# EAGLE design latch_THT_XOR (EAGLE 8.3.1)
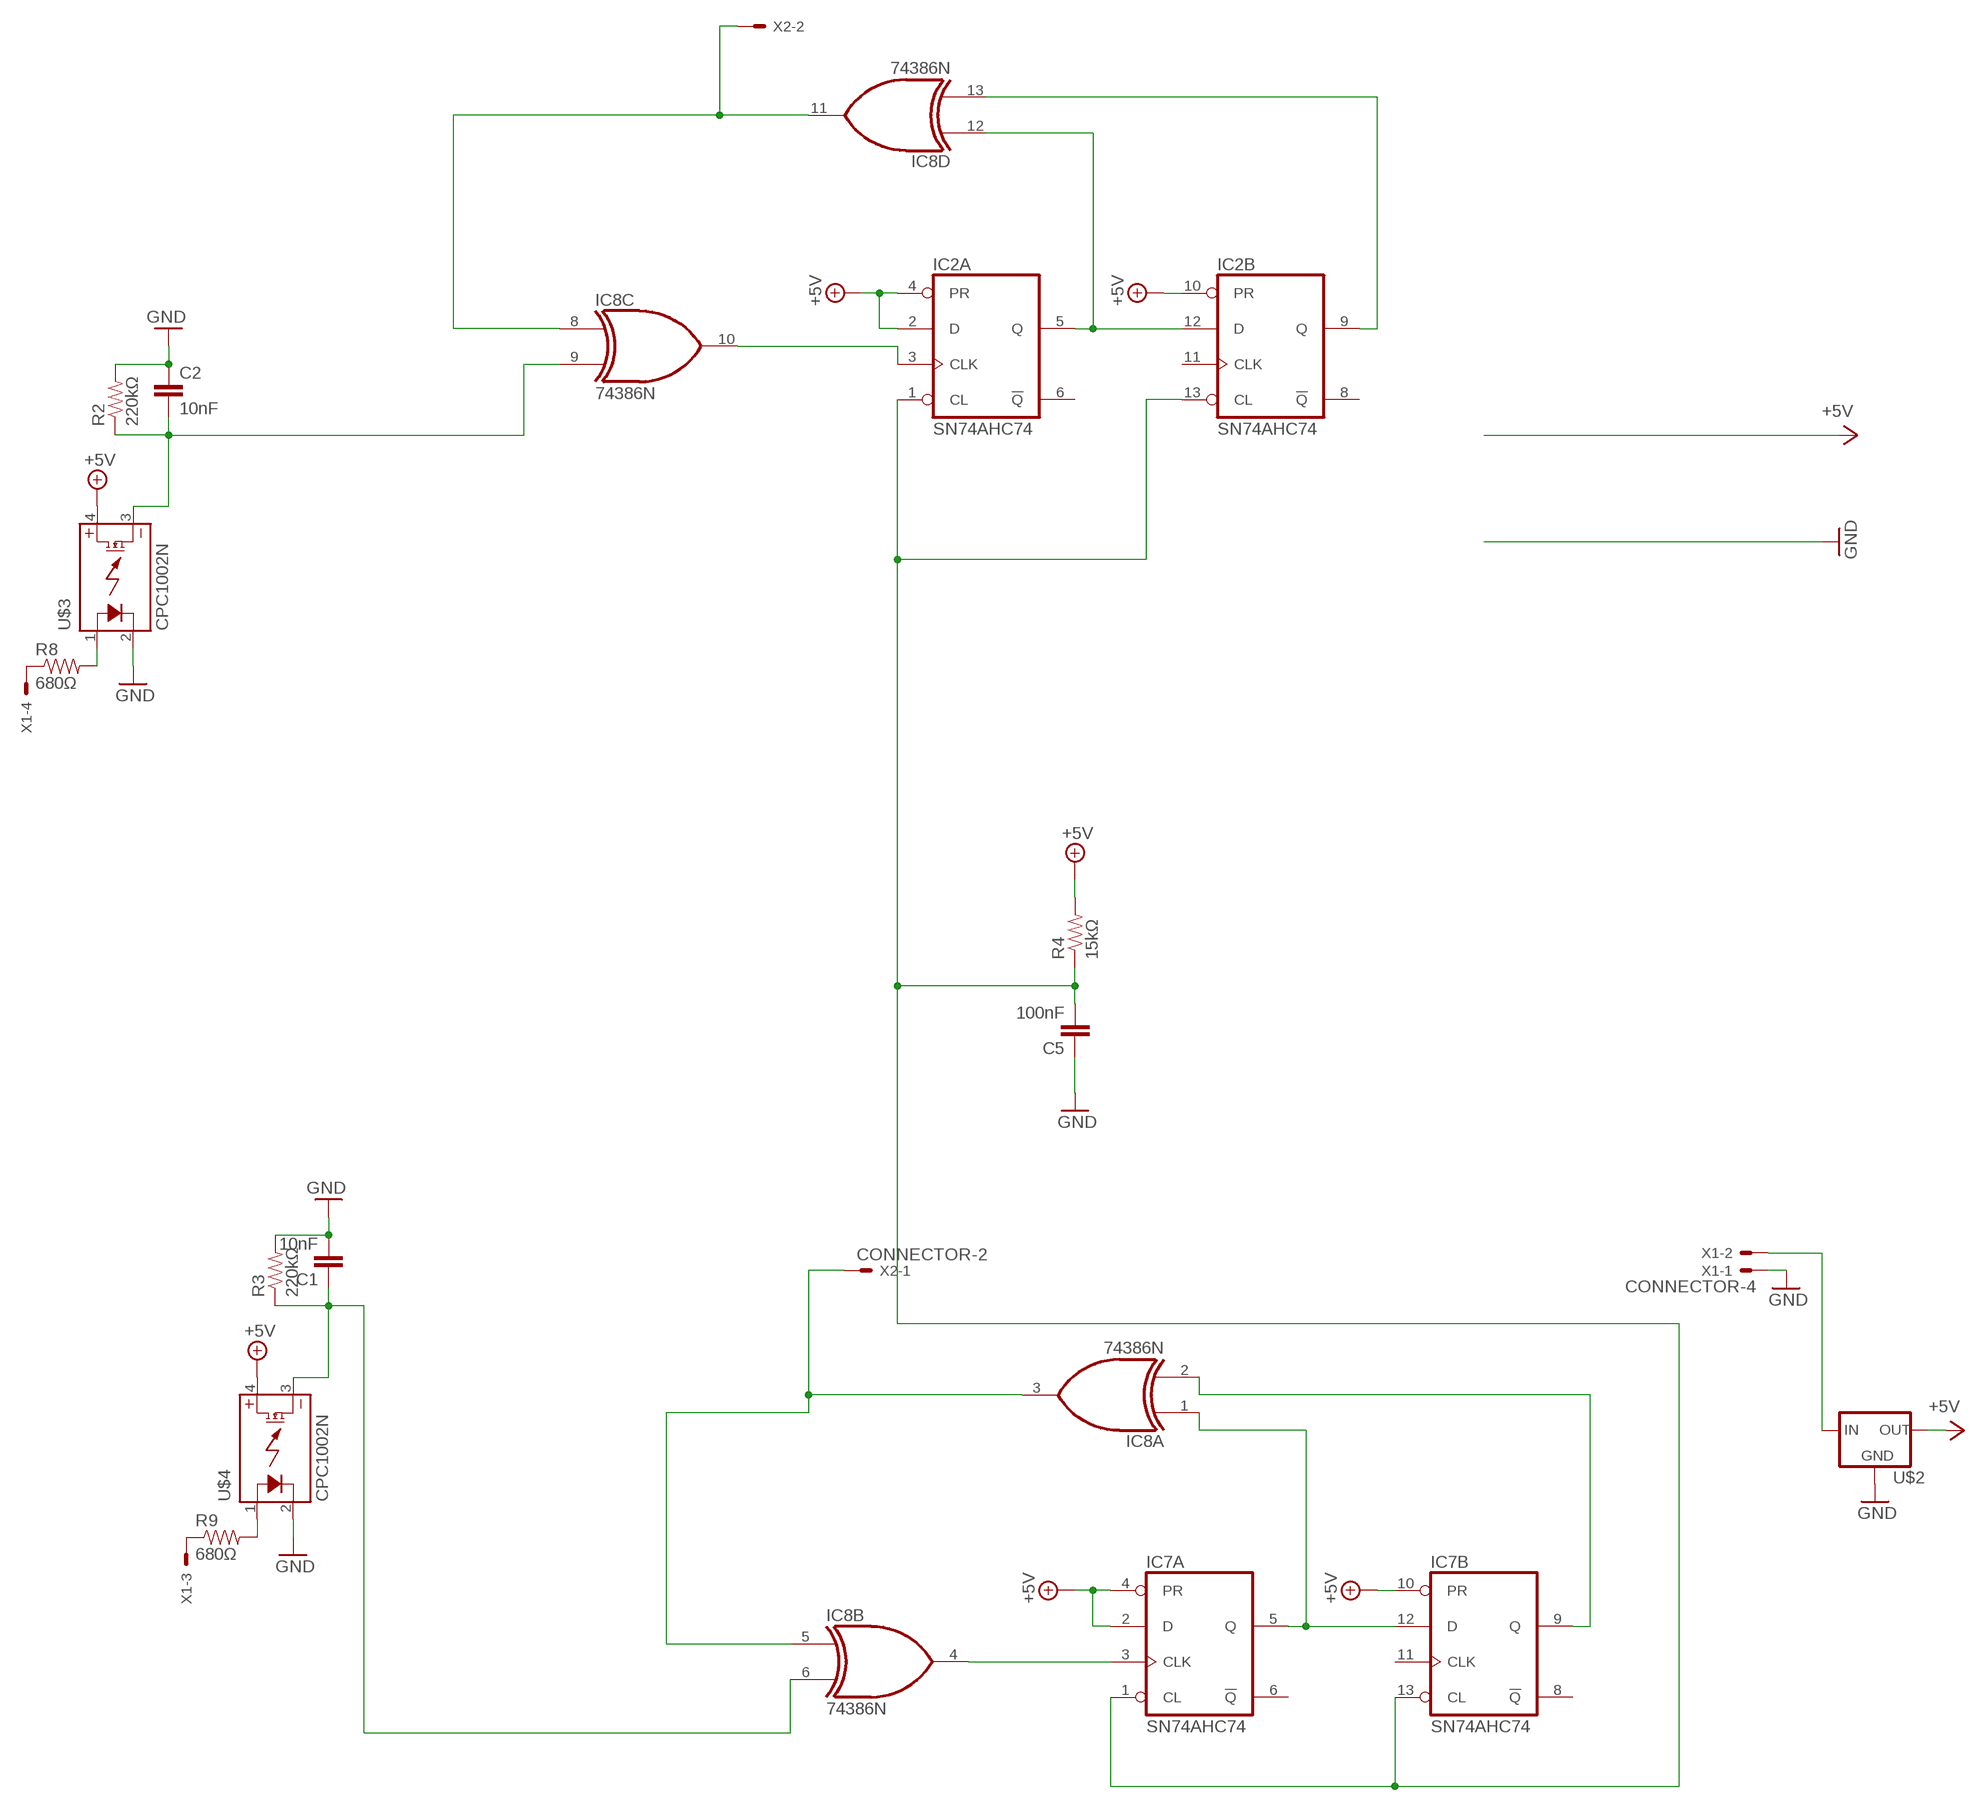
[diagram p0: schematic, sheet 1]

## Parts
C1  10nF  CAP_  [AXIAL-5MM]
C2  10nF  CAP_  [AXIAL-5MM]
C5  100nF  CAP_  [AXIAL-5MM]
IC2  SN74AHC74  [DIL14]
IC7  SN74AHC74  [DIL14]
IC8  74386N  [DIL14]
R2  220kΩ  RESISTORPTH-1/4W  [AXIAL-0.4]
R3  220kΩ  RESISTORPTH-1/4W  [AXIAL-0.4]
R4  15kΩ  RESISTORPTH-1/4W  [AXIAL-0.4]
R8  680Ω  RESISTORPTH-1/4W  [AXIAL-0.4]
R9  680Ω  RESISTORPTH-1/4W  [AXIAL-0.4]
U$2  5VREG_LM340-NLM340T-5.0/NOPB  [TO-220]
U$3  CPC1002N  [SOP04]
U$4  CPC1002N  [SOP04]
X1  CONNECTOR-4  [MINIFIT_5566-4]
X2  CONNECTOR-2  [MINIFIT_5566-2]

## Nets
12V: U$2.1(IN) X1.2
+5V: IC2.2(A:D) IC2.4(A:PR) IC2.10(B:PR) IC7.2(A:D) IC7.4(A:PR) IC7.10(B:PR) R4.P$2 U$2.3(OUT) U$3.4(DC+) U$4.4(DC+)
BMS_IN: R9.P$2 U$4.1(CONTROL+)
GND: C1.P$2 C2.P$1 C5.P$1 R2.P$2 R3.P$2 U$2.2(GND) U$3.2(CONTROL-) U$4.2(CONTROL-) X1.1
IMD_IN: R8.P$2 U$3.1(CONTROL+)
N$1: IC2.5(A:Q) IC2.12(B:D) IC8.12(D:I0)
N$2: IC2.9(B:Q) IC8.13(D:I1)
N$3: C5.P$2 IC2.1(A:CL) IC2.13(B:CL) IC7.1(A:CL) IC7.13(B:CL) R4.P$1
N$4: IC8.8(C:I0) IC8.11(D:O) X2.2
N$5: IC2.3(A:CLK) IC8.10(C:O)
N$6: IC7.3(A:CLK) IC8.4(B:O)
N$8: C1.P$1 IC8.6(B:I1) R3.P$1 U$4.3(DC-)
N$9: C2.P$2 IC8.9(C:I1) R2.P$1 U$3.3(DC-)
N$10: IC7.5(A:Q) IC7.12(B:D) IC8.1(A:I0)
N$11: IC7.9(B:Q) IC8.2(A:I1)
N$12: IC8.3(A:O) IC8.5(B:I0) X2.1
N$32: R8.P$1 X1.4
N$33: R9.P$1 X1.3
Unconnected: IC2.6(A:!Q) IC2.8(B:!Q) IC2.11(B:CLK) IC7.6(A:!Q) IC7.8(B:!Q) IC7.11(B:CLK)

## Power pins joined to a net without a drawn wire
+5V: IC2.14(P:VCC) IC7.14(P:VCC) IC8.14(P:VCC)
GND: IC2.7(P:GND) IC7.7(P:GND) IC8.7(P:GND)

## Library data of the parts
C1 C2 C5 = HyTechDevices:CAP: Capacitor Standard 0603 ceramic capacitor, and 0.1" leaded capacitor.
IC2 IC7 = HyTechDevices:SN74AHC74: TI SN74AHC74 Dual positive edge triggered D-type FLIP FLOP
IC8 = 74xx-us:74*386: Quadruple 2-input EXCLUSIVE-OR (XOR) gate
R2-R4 R8 R9 = HyTechDevices:RESISTOR: Resistor Basic schematic elements and footprints for 0603, 1206, and PTH resistors.
U$2 = HyTechDevices:5VREG_LM340-N: Voltage Regulator 5v linear voltage regulator Datasheet <http://www.mouser.com/ProductDetail/Texas-Instruments/LM340MPX-50-NOPB/?qs=X1J7HmVL2ZGZwtTFRQ9ItA%3D%3D> MAX current out: 1.5A MAX voltage in: 35V
U$3 U$4 = HyTechDevices:CPC1002N: IXYS Solid State Relay .7A
X1 = HyTechDevices:CONNECTOR-4: Mini-Fit Junior connector 4 pole Source: http://www.molex.com; OC_FARNELL: unknown; OC_NEWARK: unknown
X2 = HyTechDevices:CONNECTOR-2: Mini-Fit Junior connector 2 pole Source: http://www.molex.com; OC_FARNELL: 1822072; OC_NEWARK: unknown

## Net classes
0 default: width 0.406 mm, drill 0.406 mm, clearance 0.406 mm

## Board
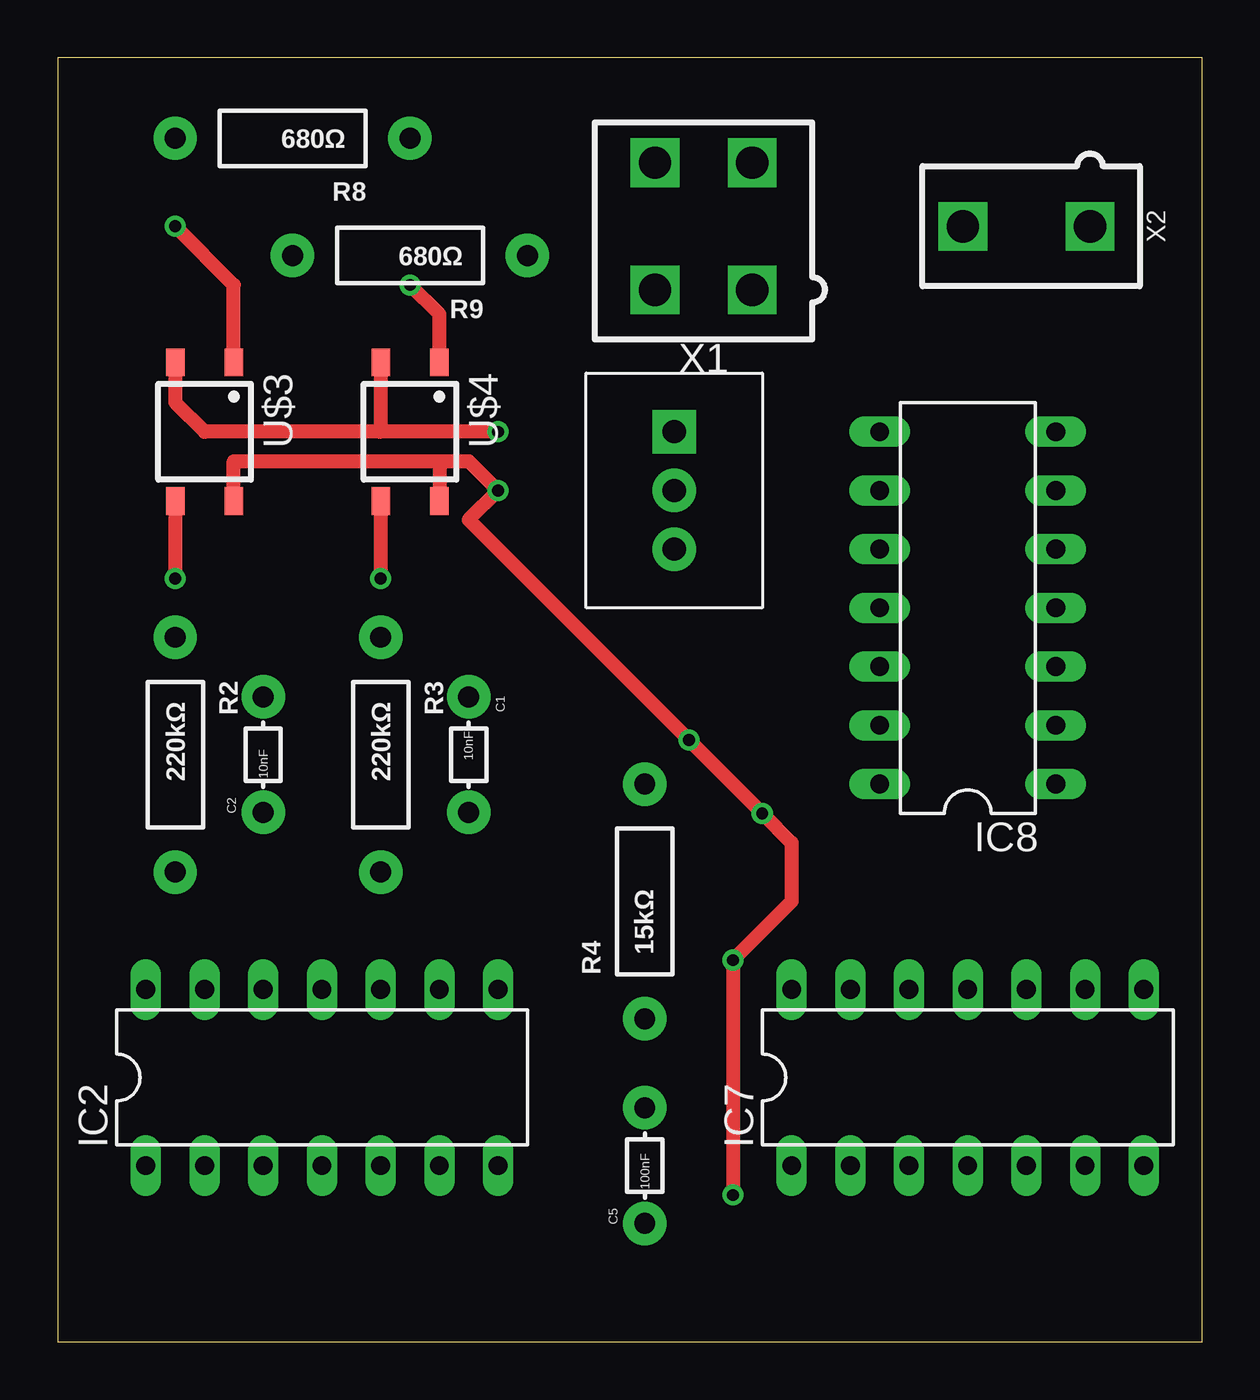
[diagram p1: board, top side]
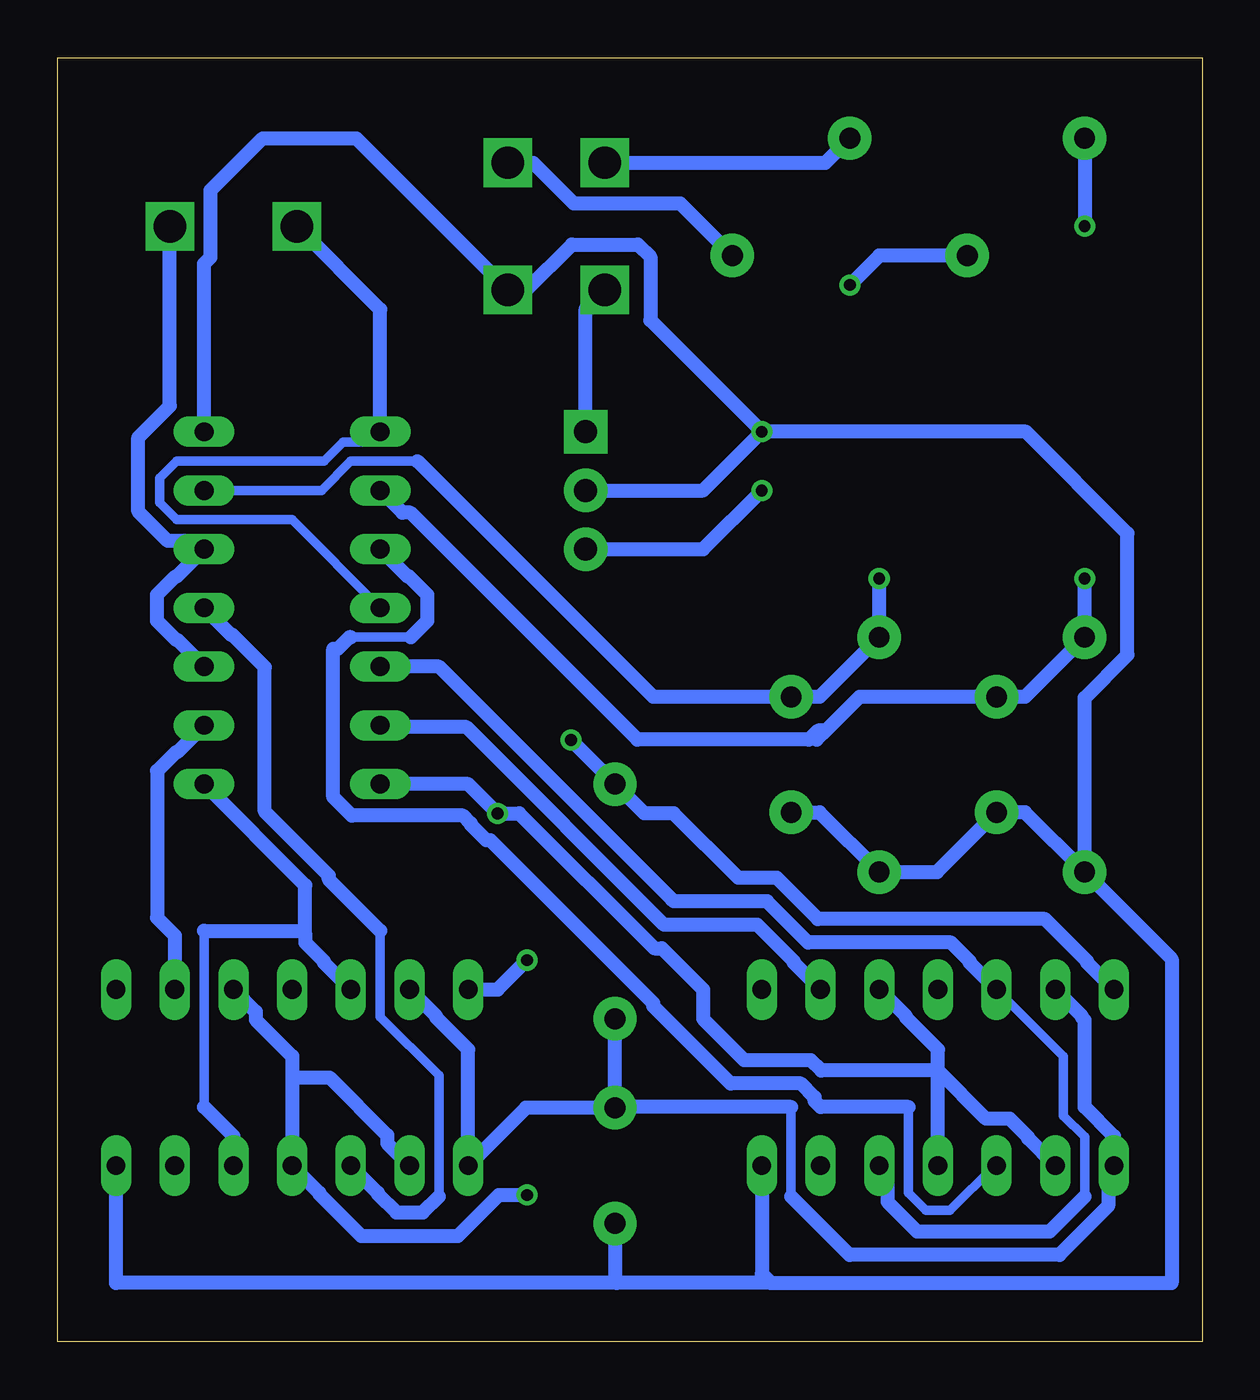
[diagram p2: board, bottom side, seen from below]

Size 49.51 x 55.55 mm. Coordinates in mm from the lower left corner, seen from the top.
Outline: 0,0 49.51,0 49.51,55.55 0,55.55 0,0
Copper layers (1*16): Top 0.035mm / dielectric 1.5mm / Bottom 0.035mm
Design rules "default *": minimum track width 6mil, minimum drill 0.35mm, track to track 16mil, track to pad 16mil, pad to pad 16mil, via to via 16mil, smd to smd 16mil, copper to edge 40mil, drill to drill 6mil, minimum pad ring 10mil, minimum via ring 8mil, stop-mask expansion 4mil, vias tented up to drill 0mil, thermal gap 10mil

### Footprints (pad centres in the part's own frame; a part is rotated, then mirrored left to right if it is on the bottom)
AXIAL-5MM = drill 0.9 pad 1.88: P$1 -2.5,0; P$2 2.5,0
DIL14 = drill 0.813 long: 1 -7.62,-3.81; 2 -5.08,-3.81; 3 -2.54,-3.81; 4 0,-3.81; 5 2.54,-3.81; 6 5.08,-3.81; 7 7.62,-3.81; 8 7.62,3.81; 9 5.08,3.81; 10 2.54,3.81; 11 0,3.81; 12 -2.54,3.81; 13 -5.08,3.81; 14 -7.62,3.81
AXIAL-0.4 = drill 0.9 pad 1.88: P$1 -5.08,0; P$2 5.08,0
TO-220 = drill 1 pad 1.88 square: 1 -2.54,0 | drill 1 pad 1.88: 2 0,0; 3 2.54,0
SOP04 = smd 0.8 x 1.2: 1 -1.27,-3; 2 1.27,-3; 3 1.27,3; 4 -1.27,3
MINIFIT_5566-4 = drill 1.4 square: 1 2.1,-2.75; 2 -2.1,-2.75; 3 2.1,2.75; 4 -2.1,2.75
MINIFIT_5566-2 = drill 1.4 square: 1 0,-2.75; 2 0,2.75

### Placement (x,y rotation side)
C1  17.78,25.4 270 top
C2  8.89,25.4 90 top
C5  25.4,7.62 90 top
IC2  11.43,11.43 0 top
IC7  39.37,11.43 0 top
IC8  39.37,31.75 90 top
R2  5.08,25.4 270 top
R3  13.97,25.4 270 top
R4  25.4,19.05 90 top
R8  10.16,52.07 180 top
R9  15.24,46.99 180 top
U$2  26.67,36.83 270 top
U$3  6.35,39.37 180 top
U$4  15.24,39.37 180 top
X1  27.94,48.26 0 top
X2  41.91,48.26 90 top

### Tracks (layer width: path | path; a pad name or v marks a point on that pad's centre or on a via)
12V
  Bottom 0.61: U$2.1 26.67,44.68 X1.2
+5V  (via drill 0.51)
  Top 0.61: U$3.4 7.62,38.1 16.51,38.1 | 16.51,38.1 U$4.4 | 16.51,38.1 17.78,38.1 v19.05,36.83 17.78,35.56 v27.3,26.03 v30.48,22.86 31.75,21.59 31.75,19.05 v29.21,16.51 v29.21,6.35
  Bottom 0.61: IC7.10 40.95,14.27 40.95,13.93 39.37,12.35 39.37,11.43 | 39.37,11.43 IC7.4 38.2,6.45 38.2,6.39 36.38,4.57 32.2,4.57 30.42,6.35 v29.21,6.35 | IC7.2 35.26,8.58 35.26,8.93 37.75,11.43 39.37,11.43 | U$2.3 21.59,34.29 v19.05,36.83 | IC2.10 12.8,14.07 12.8,14.01 11.43,12.64 11.43,11.73 | IC2.4 11.43,11.73 | 11.43,11.73 9.35,9.65 8.32,9.65 7.52,8.85 7.52,8.79 IC2.2 | 11.43,11.73 16.48,11.73 16.94,12.19 19.81,12.19 21.59,13.97 21.59,15.24 23.37,17.02 23.7,17.02 29.54,22.86 v30.48,22.86 31.75,24.13 IC8.14 | v27.3,26.03 R4.P$2 24.13,22.86 22.86,22.86 20.07,20.07 18.4,20.07 16.62,18.29 6.8,18.29 4.98,16.47 4.98,16.41 IC2.14 | IC7.14 30.48,15.24 v29.21,16.51
BMS_IN  (via drill 0.51)
  Top 0.61: U$4.1 16.51,44.45 v15.24,45.72
  Bottom 0.61: R9.P$2 13.97,46.99 v15.24,45.72
GND  (via drill 0.51)
  Top 0.61: U$3.2 5.08,40.64 6.35,39.37 13.94,39.37 | v19.05,39.37 13.94,39.37 | U$4.2 13.97,39.4 13.94,39.37
  Bottom 0.61: v19.05,39.37 23.88,44.2 23.88,46.94 24.41,47.47 27.27,47.47 29.23,45.51 X1.1 36.6,52.07 40.64,52.07 42.9,49.81 42.9,46.91 43.18,46.63 IC8.7 | R2.P$2 7.66,22.9 C2.P$1 11.47,20.32 R3.P$2 16.55,22.9 C1.P$2 | R2.P$2 5.08,27.86 3.23,29.71 3.23,34.98 7.62,39.37 v19.05,39.37 | R2.P$2 1.32,16.56 1.32,2.54 18.66,2.54 | U$2.2 21.59,36.83 v19.05,39.37 | IC7.7 46.99,2.54 25.34,2.54 | 18.66,2.54 25.34,2.54 | C5.P$1 25.4,2.6 25.34,2.54 | IC2.7 19.05,2.93 18.66,2.54
IMD_IN  (via drill 0.51)
  Top 0.61: U$3.1 7.62,45.72 v5.08,48.26
  Bottom 0.61: R8.P$2 v5.08,48.26
N$1
  Bottom 0.406: 5.08,6.29 5.08,8.87 5.99,9.78 5.99,12.34 IC2.12
  Bottom 0.61: 22.94,19.13 22.86,19.05 | 22.94,19.13 33.02,29.21 IC8.12 | IC2.5 13.61,7.26 13.61,6.05 12.34,4.77 6.59,4.77 5.08,6.29 | 22.86,19.05 22.94,19.13 | 22.86,19.05 18.82,19.05 17.05,17.27 10.86,17.27 10.06,16.47 10.06,16.41 IC2.12
N$2
  Bottom 0.61: IC2.9 17.68,16.41 17.68,16.47 19.24,18.03 23.28,18.03 31.83,26.59 35.48,26.59 IC8.13
N$3
  Bottom 0.406: 17.78,6.29 17.78,10.16
  Bottom 0.61: C5.P$2 R4.P$1 | C5.P$2 29.25,10.12 IC7.1 31.75,12.64 33.12,14.01 33.12,14.07 IC7.13 | IC2.13 5.18,14.07 5.18,14.01 5.08,13.91 5.08,10.16 3.81,8.89 IC2.1 4.06,7.37 4.06,5.87 6.17,3.76 15.25,3.76 17.78,6.29 | 17.78,10.16 25.36,10.16 C5.P$2
N$4
  Bottom 0.406: IC8.8 36.02,38.91 37.17,38.91 37.98,38.1 44.37,38.1 45.11,37.36 45.11,36.3 44.37,35.56 39.37,35.56 IC8.11
  Bottom 0.61: IC8.8 35.56,44.66 X2.2
N$5
  Bottom 0.406: 34.23,30.48 36.83,30.48 | 12.7,10.16 12.7,6.43 11.96,5.69 10.9,5.69 8.97,7.62 IC2.3
  Bottom 0.61: 34.23,30.48 33.53,31.18 33.53,32.32 34.33,33.12 34.39,33.12 IC8.10 | 36.83,30.48 36.89,30.48 37.4,29.97 37.59,29.97 37.59,23.56 36.79,22.76 31.98,22.76 31.65,22.42 31.65,22.38 30.96,21.69 30.79,21.69 23.75,14.65 23.75,14.52 20.4,11.18 17.36,11.18 16.76,10.58 16.76,10.41 16.51,10.16 12.7,10.16
N$6
  Bottom 0.406: 35.56,17.78 35.56,14.05 33.02,11.51 33.02,6.29
  Bottom 0.61: 33.02,6.29 33.72,5.59 34.86,5.59 35.66,6.39 35.66,6.45 IC7.3 | IC8.4 42.01,30.58 41.95,30.58 40.56,29.19 40.56,22.94 37.79,20.17 37.79,20.01 35.56,17.78
N$8  (via drill 0.51)
  Top 0.61: U$4.3 v13.97,33.02
  Bottom 0.406: 33.94,38.1 36.83,38.1 38.1,36.83 IC8.6
  Bottom 0.61: v13.97,33.02 R3.P$1 16.55,27.9 C1.P$1 23.74,27.9 33.94,38.1
N$9  (via drill 0.51)
  Top 0.61: U$3.3 v5.08,33.02
  Bottom 0.61: v5.08,33.02 R2.P$1 7.66,27.9 C2.P$2 14.83,27.9 16.28,26.44 | 16.28,26.44 16.68,26.05 | 16.28,26.44 16.61,26.44 17.01,26.05 24.43,26.05 34.25,35.86 34.59,35.86 IC8.9
N$10
  Bottom 0.406: 43.18,10.16 43.18,17.78
  Bottom 0.61: IC7.12 38,16.41 38,16.47 38.8,17.27 38.8,17.61 | 38.8,17.61 38.8,19.75 IC8.1 | IC7.5 41.91,8.89 43.18,10.16 | 43.18,17.78 38.97,17.78 38.8,17.61
N$11
  Bottom 0.61: IC8.2 44.35,25.5 44.41,25.5 45.21,24.7 45.21,18.34 44.45,17.58 IC7.9
N$12
  Bottom 0.61: IC8.3 44.35,30.38 44.41,30.38 45.21,31.18 45.21,32.32 44.41,33.12 44.35,33.12 IC8.5 43.54,34.65 44.74,34.65 46.02,35.92 46.02,39.12 44.66,40.49 X2.1
N$32
  Bottom 0.61: X1.4 16.3,51.01 R8.P$1
N$33
  Bottom 0.61: X1.3 28.95,51.01 27.18,49.25 22.58,49.25 R9.P$1